# Altium schematic sheet livestream.SchDoc
size A
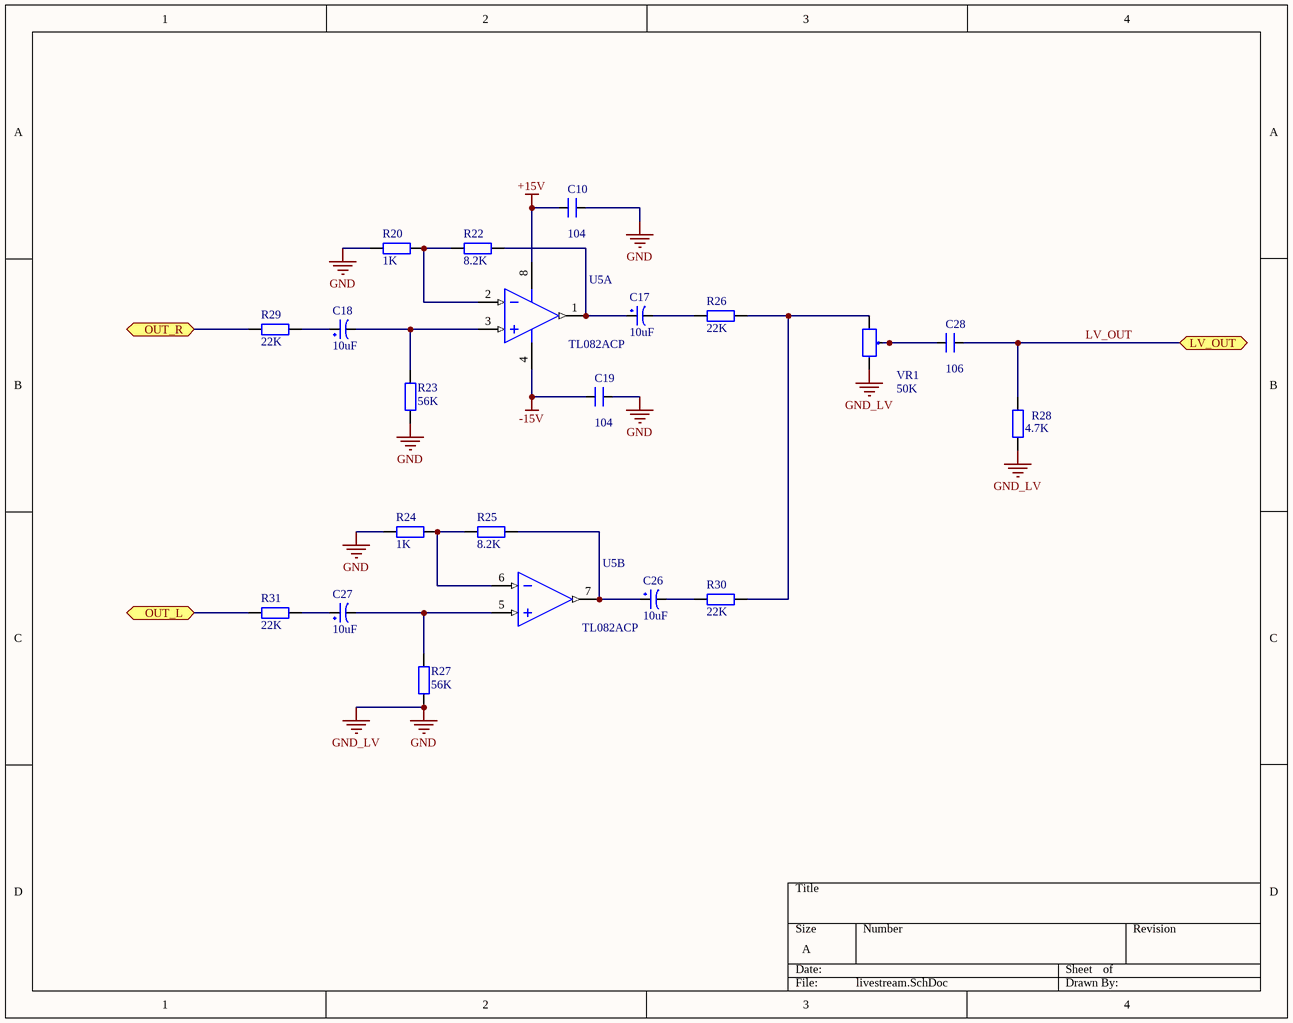
[diagram p0: livestream.SchDoc]

## Parts
C10  104  [0805_HV]
C17  10uF  [0805_HV]
C18  10uF  [0805_HV]
C19  104  [0805_HV]
C26  10uF  [0805_HV]
C27  10uF  [0805_HV]
C28  106  [0805_HV]
R20  1K  [0805_HV]
R22  8.2K  [0805_HV]
R23  56K  [0805_HV]
R24  1K  [0805_HV]
R25  8.2K  [0805_HV]
R26  22K  [0805_HV]
R27  56K  [0805_HV]
R28  4.7K  [0805_HV]
R29  22K  [0805_HV]
R30  22K  [0805_HV]
R31  22K  [0805_HV]
U5  TL082ACP  [SOP 8]  (parts A,B of 2)
VR1  50K  [VR-3V]

## Ports
LV_OUT, OUT_L, OUT_R

## Nets
+15V: C10.1 U5.8(V+)
-15V: C19.1 U5.4(V-)
GND: C10.2 C19.2 R20.1 R23.1 R24.1 R27.1 R28.2 VR1.3  [also labelled GND_LV]
LV_OUT: C28.2 R28.1 ; port LV_OUT
OUT_L: R31.1 ; port OUT_L
OUT_R: R29.1 ; port OUT_R
NetC17_1: C17.1 R22.1 U5.1(OUT)
NetC17_2: C17.2 R26.1
NetC18_1: C18.1 R29.2
NetC18_2: C18.2 R23.2 U5.3(IN+)
NetC26_1: C26.1 R25.1 U5.7(OUT)
NetC26_2: C26.2 R30.1
NetC27_1: C27.1 R31.2
NetC27_2: C27.2 R27.2 U5.5(IN+)
NetC28_1: C28.1 VR1.2
NetR20_2: R20.2 R22.2 U5.2(IN-)
NetR24_2: R24.2 R25.2 U5.6(IN-)
NetR26_2: R26.2 R30.2 VR1.1

## Library data of the parts
C10 C19 C28 = TU_MICA_ 104 100V(2A104J)_MH: Value: 0.1uF
C17 C26 = TU_HOA_4.7uF_100V_MH: Value: 4700uF/50V
C18 C27 = TU_HOA_10uF_16V_MH: Value: 10uF/50V; Description 1: 10 => 220uF/6,3V/10V - 10uF => 100uF/16V; Description 2: 0,1uF => 33uF/50V - 10uF => 22uF/63V; Description 3: 0,47uF => 10uF/100V
R20 R22-R31 = TRO_VACH_1/4W_MH
U5 = TL082ACP: JFET-Input Operational Amplifier; Published: 17-Jul-2002; LatestRevisionDate: 06-Jun-2005; LatestRevisionNote: Stylized 3D Model Added.; DatasheetVersion: 1988; PackageReference: 626-05; Publisher: Altium Limited; PackageDescription: DIP; 8 Leads; Row Spacing 7.62 mm; Pitch 2.54 mm; ComponentLink1Description: Manufacturer Link; ComponentLink1URL: http://www.onsemi.com/site/products/parametrics/0,4446,251,00.html
VR1 = BIEN_TRO_VR 204-200K 3296W_MH: VR-vuong